# Altium schematic sheet Driver.SchDoc
size A3; SheetNumber: 1; SheetTotal: 1
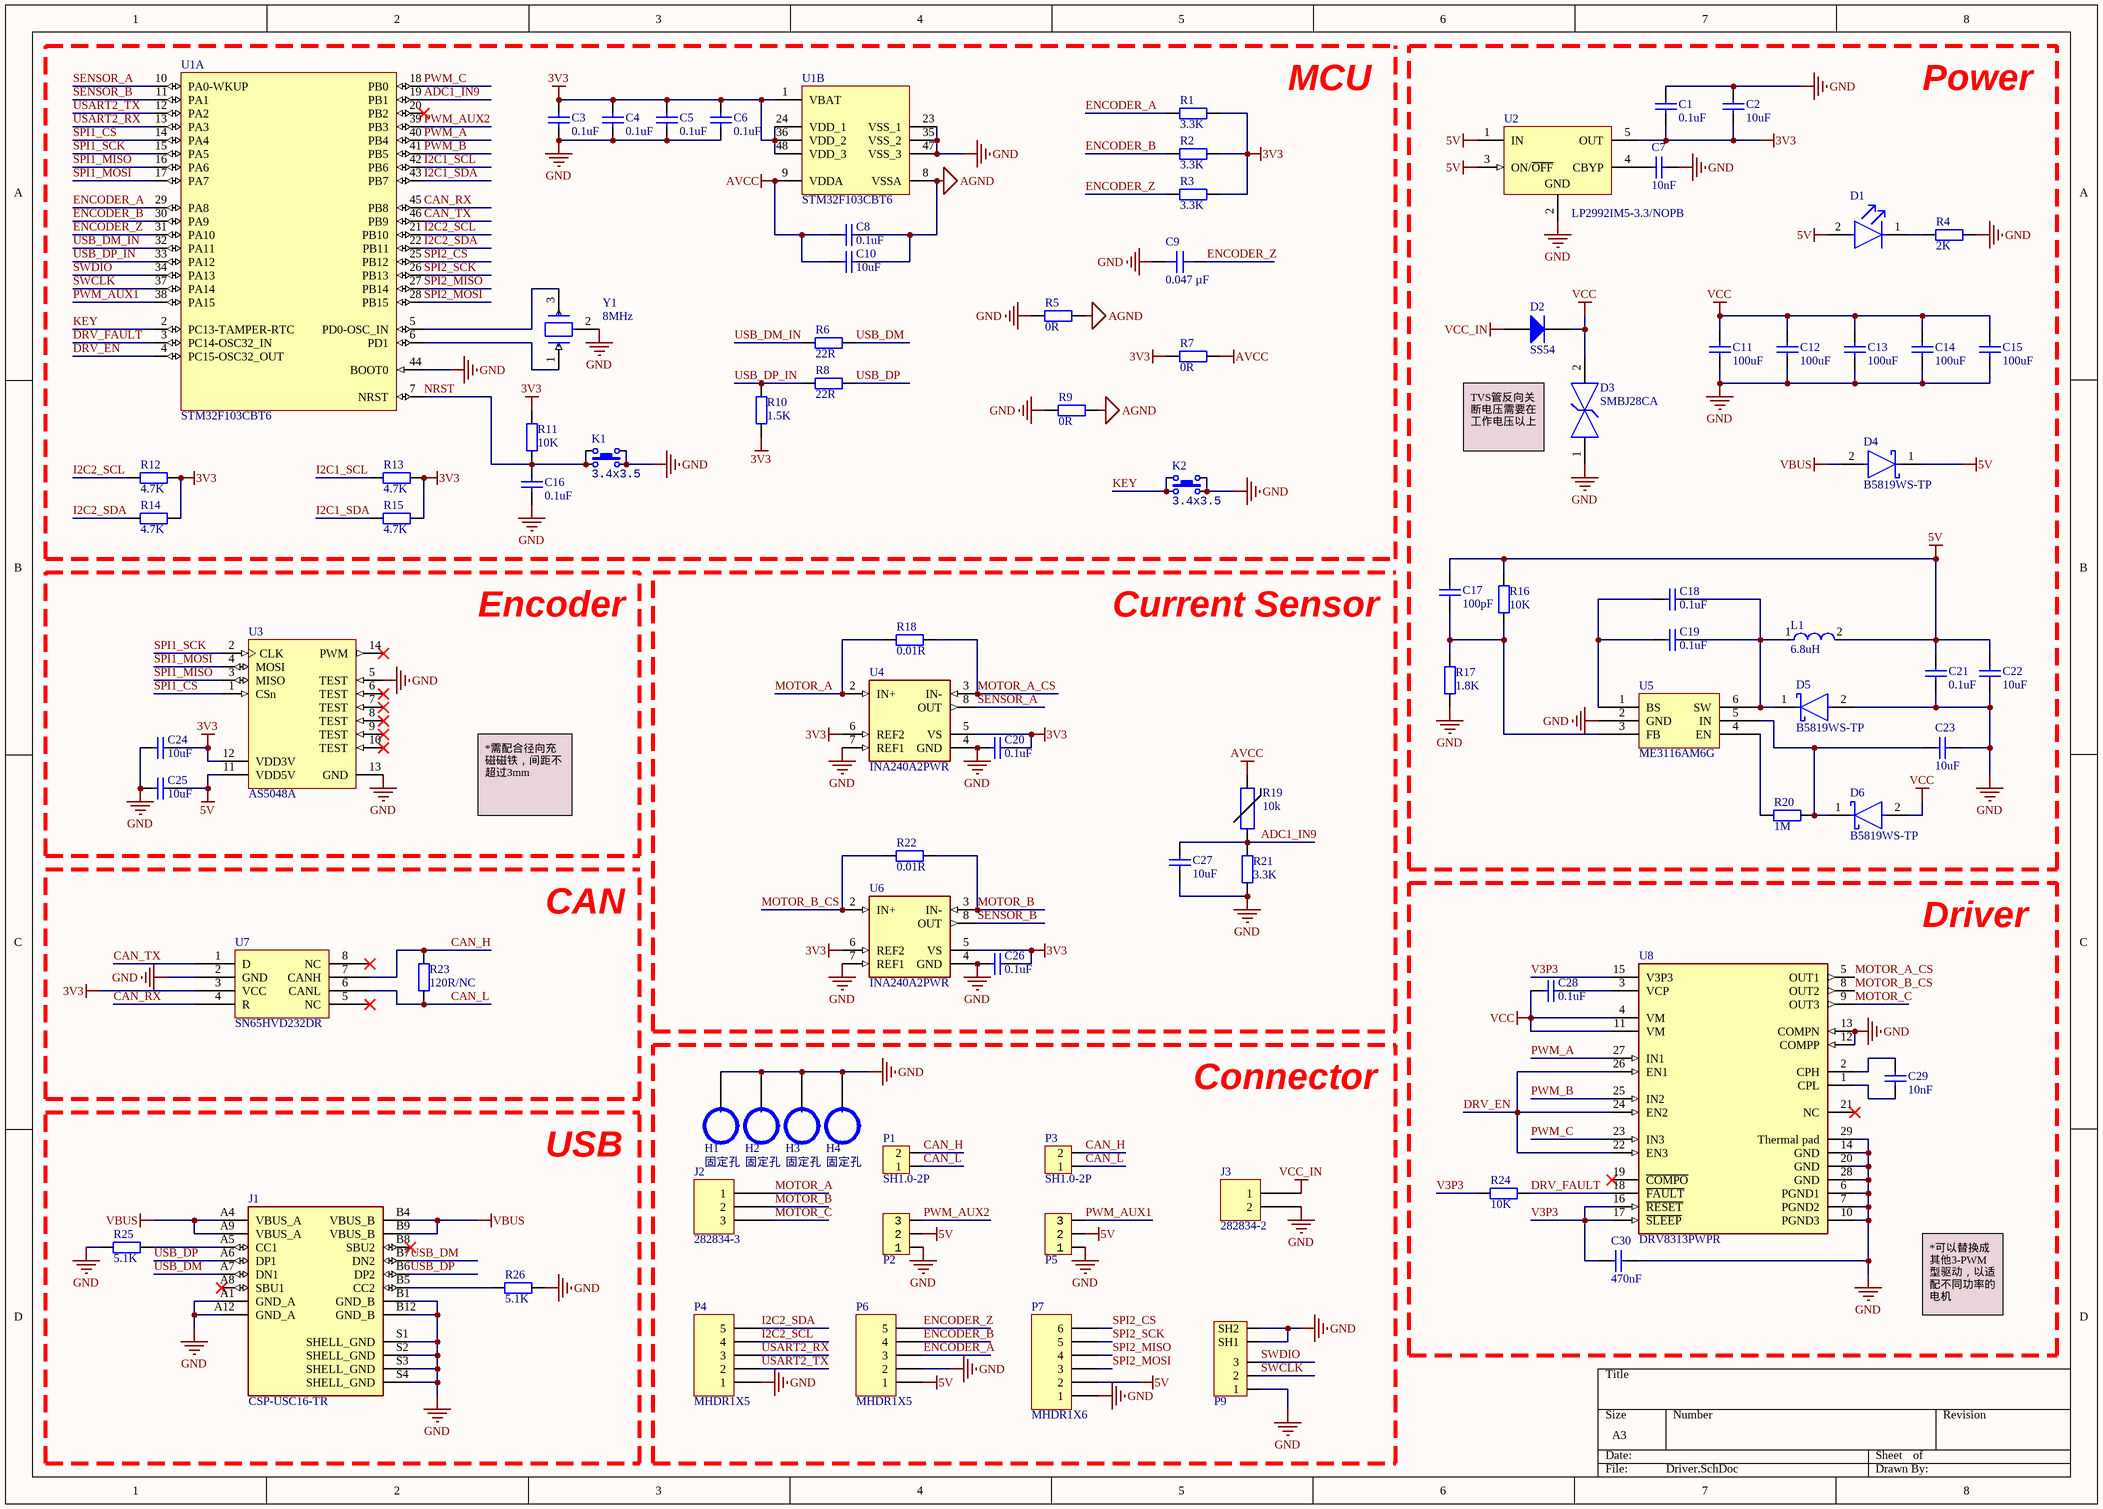
[diagram p0: Driver.SchDoc]

## Parts
C1  0.1uF  [0402_C]
C2  10uF  [0402_C]
C3  0.1uF  [0402_C]
C4  0.1uF  [0402_C]
C5  0.1uF  [0402_C]
C6  0.1uF  [0402_C]
C7  10nF  [0402_C]
C8  0.1uF  [0402_C]
C9  0.047 µF  [CAP 0402_1005]
C10  10uF  [0402_C]
C11  100uF  [CAPC3216X190X55LL30T25]
C12  100uF  [CAPC3216X190X55LL30T25]
C13  100uF  [CAPC3216X190X55LL30T25]
C14  100uF  [CAPC3216X190X55LL30T25]
C15  100uF  [CAPC3216X190X55LL30T25]
C16  0.1uF  [0402_C]
C17  100pF  [0402_C]
C18  0.1uF  [0402_C]
C19  0.1uF  [0402_C]
C20  0.1uF  [0402_C]
C21  0.1uF  [0402_C]
C22  10uF  [0402_C]
C23  10uF  [0402_C]
C24  10uF  [0402_C]
C25  10uF  [0402_C]
C26  0.1uF  [0402_C]
C27  10uF  [0402_C]
C28  0.1uF  [0402_C]
C29  10nF  [0402_C]
C30  470nF  [0402_C]
D1  (no value)  [FP-APHHS1005CGCK-MFG]
D2  SS54  [SMA(DO-214AC)_S1]
D3  SMBJ28CA  [FP-SMBJ-CA-MFG]
D4  B5819WS-TP  [FP-SOD-323-IPC_C]
D5  B5819WS-TP  [FP-SOD-323-IPC_C]
D6  B5819WS-TP  [FP-SOD-323-IPC_C]
H1  固定孔  [铜柱孔3]
H2  固定孔  [铜柱孔3]
H3  固定孔  [铜柱孔3]
H4  固定孔  [铜柱孔3]
J1  CSP-USC16-TR  [VALCON_CSP-USC16-TR]
J2  282834-3  [TE 282834-3]
J3  282834-2  [TE 282834-2]
K1  value 3.4x3.5  [ButtonTACT_3.5*3.55_90]  (hidden comment: TACT 4P)
K2  value 3.4x3.5  [ButtonTACT_3.5*3.55_90]  (hidden comment: TACT 4P)
L1  6.8uH  [FP-LQH2MCN_52-MFG]
P1  SH1.0-2P  [SH1.0-2P]
P2  HDR1x3_2.54  [HDR1X3_2.54_180]  (value not drawn)
P3  SH1.0-2P  [SH1.0-2P]
P4  MHDR1X5  [MHDR1X5]
P5  HDR1x3_2.54  [HDR1X3_2.54_180]  (value not drawn)
P6  MHDR1X5  [MHDR1X5]
P7  MHDR1X6  [MHDR1X6]
P9  SH1.0-3P  [SH1.0-3P]  (value not drawn)
R1  3.3K  [0402_R]
R2  3.3K  [0402_R]
R3  3.3K  [0402_R]
R4  2K  [0402_R]
R5  0R  [0402_R]
R6  22R  [0402_R]
R7  0R  [0402_R]
R8  22R  [0402_R]
R9  0R  [0402_R]
R10  1.5K  [0402_R]
R11  10K  [0402_R]
R12  4.7K  [0402_R]
R13  4.7K  [0402_R]
R14  4.7K  [0402_R]
R15  4.7K  [0402_R]
R16  10K  [0402_R]
R17  1.8K  [0402_R]
R18  0.01R  [0402_R]
R19  value 10k  [RES_0402]  (hidden comment: NCP15XH103F03RC)
R20  1M  [0402_R]
R21  3.3K  [0402_R]
R22  0.01R  [0402_R]
R23  120R/NC  [0402_R]
R24  10K  [0402_R]
R25  5.1K  [0402_R]
R26  5.1K  [0402_R]
U1  STM32F103CBT6  [LQFP-48_7x7x05P]  (parts A,B of 2)
U2  LP2992IM5-3.3/NOPB  [DBV0005A_L]
U3  AS5048A  [TSSOP-14]
U4  INA240A2PWR  [SOP65 P640X120-8N]
U5  ME3116AM6G  [SOT-23-6]
U6  INA240A2PWR  [SOP65 P640X120-8N]
U7  Manufacturer Part Number: SN65HVD232DR  [SO-8]  (hidden comment: SN65HVD232D)
U8  DRV8313PWPR  [FP-PWP0028C-IPC_B]
Y1  8MHz  [FP-CSTNE8M00GH5C000R0-MFG]

## Blocks framed on the sheet
MCU: C3-C6 C8-C10 C16 K1 K2 R1-R3 R5-R15 U1 Y1
Power: C1 C2 C7 C11-C15 C17-C19 C21-C23 D1-D6 L1 R4 R16 R17 R20 U2 U5
Encoder: C24 C25 U3
Current Sensor: C20 C26 C27 R18 R19 R21 R22 U4 U6
CAN: R23 U7
Driver: C28-C30 R24 U8
Connector: H1-H4 J2 J3 P1-P7 P9
USB: J1 R25 R26

## Nets
3V3: C1.1 C2.1 C3.1 C4.1 C5.1 C6.1 C20.1 C24.1 C26.1 R1.2 R2.2 R3.2 R7.1 R10.1 R11.2 R12.2 R13.2 R14.2 R15.2 U1.1(VBAT) U1.24(VDD_1) U1.36(VDD_2) U1.48(VDD_3) U2.5(OUT) U3.12(VDD3V) U4.5(VS) U4.6(REF2) U6.5(VS) U6.6(REF2) U7.3(VCC)
5V: C17.2 C21.1 C22.2 C25.1 D1.2(A) D4.1(C) L1.2 P2.2 P5.2 P6.1 P7.2 R16.2 U2.1(IN) U2.3(ON/~{OFF}) U3.11(VDD5V)
AGND: C8.1 C10.1 R5.2 R9.2 U1.8(VSSA)
AVCC: C8.2 C10.2 R7.2 R19.2 U1.9(VDDA)
GND: C1.2 C2.2 C3.2 C4.2 C5.2 C6.2 C7.1 C9.1 C11.1 C12.1 C13.1 C14.1 C15.1 C16.2 C20.2 C21.2 C22.1 C23.1 C24.2 C25.2 C26.2 C27.2 C30.2 D3.1 D5.2(A) H1.11 H2.11 H3.11 H4.11 J1.A1(GND_A) J1.A12(GND_A) J1.B1(GND_B) J1.B12(GND_B) J1.S1(SHELL_GND) J1.S2(SHELL_GND) J1.S3(SHELL_GND) J1.S4(SHELL_GND) J3.2 K1.2 K1.4 K2.2 K2.4 P2.1 P4.1 P5.1 P6.2 P7.1 P9.1 P9.SH1 P9.SH2 R4.2 R5.1 R9.1 R17.1 R21.1 R25.2 R26.1 U1.23(VSS_1) U1.35(VSS_2) U1.44(BOOT0) U1.47(VSS_3) U2.2(GND) U3.5(TEST) U3.13(GND) U4.4(GND) U4.7(REF1) U5.2(GND) U6.4(GND) U6.7(REF1) U7.2(GND) U8.6(PGND1) U8.7(PGND2) U8.10(PGND3) U8.12(COMPP) U8.13(COMPN) U8.14(GND) U8.20(GND) U8.28(GND) U8.29(Thermal_pad) Y1.2(GND)
VBUS: D4.2(A) J1.A4(VBUS_A) J1.A9(VBUS_A) J1.B4(VBUS_B) J1.B9(VBUS_B)
VCC: C11.2 C12.2 C13.2 C14.2 C15.2 C28.2 D2.2(K) D3.2 D6.2(A) U8.4(VM) U8.11(VM)
VCC_IN: D2.1(A) J3.1
ADC1_IN9: C27.1 R19.1 R21.2 U1.19(PB1)
CAN_H: P1.2 P3.2 R23.2 U7.7(CANH)
CAN_L: P1.1 P3.1 R23.1 U7.6(CANL)
CAN_RX: U1.45(PB8) U7.4(R)
CAN_TX: U1.46(PB9) U7.1(D)
DRV_EN: U1.4(PC15-OSC32_OUT) U8.22(EN3) U8.24(EN2) U8.26(EN1)
DRV_FAULT: R24.1 U1.3(PC14-OSC32_IN) U8.18(~{FAULT})
ENCODER_A: P6.3 R1.1 U1.29(PA8)
ENCODER_B: P6.4 R2.1 U1.30(PA9)
ENCODER_Z: C9.2 P6.5 R3.1 U1.31(PA10)
I2C1_SCL: R13.1 U1.42(PB6)
I2C1_SDA: R15.1 U1.43(PB7)
I2C2_SCL: P4.4 R12.1 U1.21(PB10)
I2C2_SDA: P4.5 R14.1 U1.22(PB11)
KEY: K2.1 K2.3 U1.2(PC13-TAMPER-RTC)
MOTOR_A: J2.1 R18.2 U4.2(IN+)
MOTOR_A_CS: R18.1 U4.3(IN-) U8.5(OUT1)
MOTOR_B: J2.2 R22.1 U6.3(IN-)
MOTOR_B_CS: R22.2 U6.2(IN+) U8.8(OUT2)
MOTOR_C: J2.3 U8.9(OUT3)
NRST: C16.1 K1.1 K1.3 R11.1 U1.7(NRST)
PWM_A: U1.40(PB4) U8.27(IN1)
PWM_AUX1: P5.3 U1.38(PA15)
PWM_AUX2: P2.3 U1.39(PB3)
PWM_B: U1.41(PB5) U8.25(IN2)
PWM_C: U1.18(PB0) U8.23(IN3)
SENSOR_A: U1.10(PA0-WKUP) U4.8(OUT)
SENSOR_B: U1.11(PA1) U6.8(OUT)
SPI1_CS: U1.14(PA4) U3.1(CSn)
SPI1_MISO: U1.16(PA6) U3.3(MISO)
SPI1_MOSI: U1.17(PA7) U3.4(MOSI)
SPI1_SCK: U1.15(PA5) U3.2(CLK)
SPI2_CS: P7.6 U1.25(PB12)
SPI2_MISO: P7.4 U1.27(PB14)
SPI2_MOSI: P7.3 U1.28(PB15)
SPI2_SCK: P7.5 U1.26(PB13)
SWCLK: P9.2 U1.37(PA14)
SWDIO: P9.3 U1.34(PA13)
USART2_RX: P4.3 U1.13(PA3)
USART2_TX: P4.2 U1.12(PA2)
USB_DM: J1.A7(DN1) J1.B7(DN2) R6.2
USB_DM_IN: R6.1 U1.32(PA11)
USB_DP: J1.A6(DP1) J1.B6(DP2) R8.2
USB_DP_IN: R8.1 R10.2 U1.33(PA12)
V3P3: C30.1 R24.2 U8.15(V3P3) U8.16(~{RESET}) U8.17(~{SLEEP})
NetC7_2: C7.2 U2.4(CBYP)
NetC17_1: C17.1 R16.1 R17.2 U5.3(FB)
NetC18_1: C18.1 C19.1 D5.1(C) L1.1 U5.6(SW)
NetC18_2: C18.2 C19.2 U5.1(BS)
NetC23_2: C23.2 D6.1(C) R20.1 U5.5(IN)
NetC28_1: C28.1 U8.3(VCP)
NetC29_1: C29.1 U8.1(CPL)
NetC29_2: C29.2 U8.2(CPH)
NetD1_1: D1.1(C) R4.1
NetJ1_A5: J1.A5(CC1) R25.1
NetJ1_B5: J1.B5(CC2) R26.2
NetR20_2: R20.2 U5.4(EN)
NetU1_5: U1.5(PD0-OSC_IN) Y1.3(Output)
NetU1_6: U1.6(PD1) Y1.1(Input)

Not connected (* = marked no-connect by the designer): J1 A8(SBU1)* B8(SBU2)*; U1 20(PB2)*; U3 6(TEST)* 7(TEST)* 8(TEST)* 9(TEST)* 10(TEST)* 14(PWM)*; U7 5(NC)* 8(NC)*; U8 19(~{COMPO})* 21(NC)*

## Notes on the sheet
- TVS管反向关断电压需要在工作电压以上
- *需配合径向充磁磁铁，间距不超过3mm
- *可以替换成其他3-PWM型驱动，以适配不同功率的电机

## Library data of the parts
C1-C8 C10 C16 C18-C28 = 0402 100nF (104) 10% 16V: 贴片电容; ComponentLink1Description: 供应商链接; ComponentLink1URL: http://www.szlcsc.com/product/details_1877.html; Package: 0402; Supplier: LC; SuppliersPartNumber: C1525
C9 = C0402C473K3REC7867: CAP CER 0402 47NF 25V X7R 10%; manufacturer: KEMET; Part Number: C0402C473K3REC7867; Value: 0.047 µF; Applications: ESD Protection; Capacitance: 0.047 µF; componentlink1description: Datasheet; componentlink1url: https://api.kemet.com/component-edge/download/datasheet/C0402C473K3REC7867.pdf; componentlink2description: DigiKey Link; componentlink2url: https://www.digikey.com/en/products/detail/kemet/C0402C473K3REC7867/8643594; Device Package: 0402 (1005 Metric); lastupdated: 2022/8/26 11:23:32; Lifecycle Status: Active; Minimum Order: 1; Mounting Type: Surface Mount, MLCC; Operating Temperature: -55°C ~ 125°C; Package / Case: 0402 (1005 Metric); packaging: TapeAndReel; partid: 33555; Part Status: Active; price: 0.01; series: ESD SMD Comm X7R; Size / Dimension: 0.039" L x 0.020" W (1.00mm x 0.50mm); Supplier 1: DigiKey; Supplier Part Number 1: 399-C0402C473K3REC7867CT-ND; Temperature Coefficient: X7R; Thickness (Max): 0.022" (0.55mm); Tolerance: ±10%; Voltage - Rated: 25V
C11-C15 = CMP-1662-00011-2: Chip Capacitor, 100 uF, +/- 20%, 6.3 V, -55 to 85 degC, 1206 (3216 Metric), RoHS, Tape and Reel; PartNumber: GRM31CR60J107ME39L; Case\/Package: 1206; Voltage Rating (DC): 6.3 V; Type (Capacitors): X5R; REACH SVHC: No SVHC; Height: 1.6 mm; Tolerance: 20%; Packaging: Tape and Reel; Mount: Surface Mount; PackageDescription: 2-Pin Surface Mount Device, Body 3.2 x 1.6 mm; ComponentLink1URL: http://www.murata.com/; Pins: 2; ComponentLink2Description: Datasheet; PackageReference: 1206; Width: 1.6 mm; Package Quantity: 2000; Capacitance: 100 uF; Min Operating Temperature: -55 degC; Case Code (Imperial): 1206; Max Operating Temperature: 85 degC; DatasheetVersion: 09/2016; Mounting Technology: Surface Mount; Voltage Rating: 6.3 V; ComponentLink1Description: Manufacturer URL; Radiation Hardening: No; Case Code (Metric): 3216; Length: 3.2 mm; ComponentLink2URL: http://psearch.en.murata.com/capacitor/product/GRM31CR60J107ME39%23.pdf; RoHSCompliant: true
C17 = 0402 100pF (101) 5% 50V: 贴片电容; ComponentLink1Description: 供应商链接; ComponentLink1URL: http://www.szlcsc.com/product/details_1898.html; Package: 0402; Supplier: LC; SuppliersPartNumber: C1546
C29 = 0402 10nF (103) 10% 50V: 贴片电容; ComponentLink1Description: 供应商链接; ComponentLink1URL: http://www.szlcsc.com/product/details_15869.html; Package: 0402; Supplier: LC; SuppliersPartNumber: C15195
C30 = 0402 470nF (474) 10% 10V: 贴片电容; ComponentLink1Description: 供应商链接; ComponentLink1URL: http://www.szlcsc.com/product/details_48344.html; Package: 0402; Supplier: LC; SuppliersPartNumber: C47339
D1 = CMP-44529-000044-1: LED GREEN CLEAR CHIP SMD; Viewing Angle: 120°; Dominant Wavelength: 570nm; Test Current: 20mA; Luminous Intensity: 50mcd; Forward Voltage: 2.1V; Number of LEDs: 1; Lens Color: Clear; Packaging: Tape and Reel; Max Operating Temperature: 85°C; Illumination Color: Green; Length: 1mm; Mount: Surface Mount; Lens Style: Clear; Color: Green; Number of Pins: 2; Wavelength: 570nm; Case/Package: 0402; Width: 0.5mm; Package Quantity: 2000; Case Code (Metric): 1005; Height: 0.6mm; Lead Free: Lead Free; Case Code (Imperial): 0402; Forward Current: 20mA; Min Operating Temperature: -40°C
D2 = SMA(DO-214AC) SS54: 二极管; ComponentLink1Description: 供应商链接; ComponentLink1URL: http://www.szlcsc.com/product/details_23178.html; Package: SMA(DO-214AC); Supplier: LC; SuppliersPartNumber: C22452
D3 = CMP-08607-000057-1: TVS DIODE 28V 45.4V DO214AA; Manufacturer: Littelfuse Inc; Direction: Bidirectional; Peak Pulse Power: 600W; Max Junction Temp: +150°C; Peak Pulse Current: 13.3A; Breakdown Voltage: 31.1V; Number Of Channels: 1; Digikey Description: TVS DIODE 28V 45.4V DO214AA; Temperature Range Low: -65°C; Device Class L1: Circuit Protection; Automotive: No; Device Class L3: unset; Octopart: https://octopart.com/smbj28ca-littelfuse-350757; Temperature Range High: +150°C; Reverse Standoff Voltage: 28V; Mouser Description: In a Pack of 10, Littelfuse SMBJ28CA, Bi-Directional TVS Diode, 600W, 2-Pin DO-214AA; Category: Diode; Device Class L2: TVS Diodes; ComponentLink2URL: https://www.littelfuse.com/~/media/electronics/datasheets/tvs_diodes/littelfuse_tvs_diode_smbj_datasheet.pdf.pdf; Clamping Voltage: 45.4V; Manufacturer Part Number: SMBJ28CA; RoHS: TRUE; Height: 2.61mm; Package: SMBJ-CA; ComponentLink2Description: Datasheet; Lead Free: Yes; Temperature: -65°C to +150°C
D4-D6 = CMP-56206-000009-1: DIODE SCHOTTKY 40V 1A SOD323; Max Reverse Leakage Current: 1mA; Peak Non-Repetitive Surge Current: 10A; Forward Voltage: 900mV; Element Configuration: Single; Max Reverse Voltage (DC): 40V; Number of Pins: 2; Max Operating Temperature: 125°C; Package Quantity: 1; Radiation Hardening: No; Average Rectified Current: 1A; Lead Free: Lead Free; Series: -; Mount: Surface Mount; Min Operating Temperature: -65°C; RoHS Compliant: Yes; Packaging: Tape and Reel; Max Surge Current: 10A
J1 = CSP-USC16-TR: CSP-USC16-TR Valcon USB Type C Surface Mount PCB Socket; Package: None; Purchase-URL: https://pricing.snapeda.com/search/part/CSP-USC16-TR/?ref=eda; MP: CSP-USC16-TR; Check_prices: https://www.snapeda.com/parts/CSP-USC16-TR/Valcon/view-part/4783629/?ref=eda; MF: Valcon; Value: *; Availability: No availability data; Price: None; SnapEDA_Link: https://www.snapeda.com/parts/CSP-USC16-TR/Valcon/view-part/4783629/?ref=snap
J2 = 282834-3: TERM BLK 3P SIDE ENT 2.54MM PCB; Manufacturer: TE Connectivity AMP Connectors; Current: 10A; Mating Orientation: Horizontal with Board; Number of Levels: 1; Pitch: 0.100" (2.54mm); Positions Per Level: 3; Voltage: 150V; Wire Gauge: 16-30 AWG; Wire Termination: Screw - Rising Cage Clamp; Part Number: 282834-3; Color: Green; ComponentLink1Description: Datasheet; ComponentLink1URL: https://www.te.com/commerce/DocumentDelivery/DDEController?Action=srchrtrv&DocNm=282834&DocType=Customer+Drawing&DocLang=English; ComponentLink2Description: DigiKey Link; ComponentLink2URL: http://digikey.com/product-detail/en/te-connectivity-amp-connectors/282834-3/A98334-ND/1153264; LastUpdated: 2020/1/15 4:15:50; Lifecycle Status: Active; Minimum Order: 1; Mounting Type: Through Hole; Packaging: Bulk; Part Status: Active; Price: 2.01; Series: Buchanan; Supplier 1: DigiKey; Supplier Part Number 1: A98334-ND
J3 = 282834-2: TERM BLK 2P SIDE ENT 2.54MM PCB; Manufacturer: TE Connectivity AMP Connectors; Current: 10A; Mating Orientation: Horizontal with Board; Number of Levels: 1; Pitch: 0.100" (2.54mm); Positions Per Level: 2; Voltage: 150V; Wire Gauge: 16-30 AWG; Wire Termination: Screw - Rising Cage Clamp; Part Number: 282834-2; Color: Green; ComponentLink1Description: Datasheet; ComponentLink1URL: https://www.te.com/commerce/DocumentDelivery/DDEController?Action=srchrtrv&DocNm=282834&DocType=Customer+Drawing&DocLang=English; ComponentLink2Description: DigiKey Link; ComponentLink2URL: http://digikey.com/product-detail/en/te-connectivity-amp-connectors/282834-2/A98333-ND/1150135; LastUpdated: 2020/1/15 4:15:38; Lifecycle Status: Active; Minimum Order: 1; Mounting Type: Through Hole; Packaging: Bulk; Part Status: Active; Price: 0.88; Series: Buchanan; Supplier 1: DigiKey; Supplier Part Number 1: A98333-ND
K1 K2 = ButtonTACT: Button; type: TACT 4P
L1 = CMP-06042-015166-1: Wire Wound Ferrite Inductor for Power Lines 6.8μH ±20% 1.6Ω 285mA 0806; Shielding: Unshielded; Test Frequency: 1MHz; Self Resonant Frequency: 65MHz; DC Resistance (DCR): 1.6R; Military Standard: Not; Length: 2mm; Case Code (Metric): 2016; Current Rating: 285mA; Package Quantity: 3000; Weight: 0.000317oz; Case Code (Imperial): 0806; Max Operating Temperature: 85°C; Width: 0.063inch; DC Current: 285mA; Core Material: Ferrite; Resistor Type: Wirewound; Inductance: 6.8uH; Height - Seated (Max): 0.037inch; Max DC Current: 285mA; Depth: 1.8mm; Termination: SMD/SMT; Min Operating Temperature: -40°C; Case/Package: 0806; Mount: Surface Mount; Tolerance: 20%; Packaging: Tape and Reel; Height: 0.9mm; Radiation Hardening: No
P2 P5 = HDR1x3_2.54: Header
P4 P6 = MHDR1X5: Header, 5-Pin; LatestRevisionDate: 17-Jul-2002; LatestRevisionNote: Re-released for DXP Platform.; Publisher: Altium Limited
P7 = MHDR1X6: Header, 6-Pin; LatestRevisionDate: 17-Jul-2002; LatestRevisionNote: Re-released for DXP Platform.; Publisher: Altium Limited
P9 = SH1.0-3P: Header
R1-R3 R21 = 0402 3.3KΩ (3301) 1%: 贴片电阻; ComponentLink1Description: 供应商链接; ComponentLink1URL: http://www.szlcsc.com/product/details_26633.html; Package: 0402; Supplier: LC; SuppliersPartNumber: C25890
R4 R20 = 0402 2KΩ (2001) 1%: 贴片电阻; ComponentLink1Description: 供应商链接; ComponentLink1URL: http://www.szlcsc.com/product/details_4516.html; Package: 0402; Supplier: LC; SuppliersPartNumber: C4109
R5 R7 R9 = 0402 0Ω (0R0) 1%: 贴片电阻; ComponentLink1Description: 供应商链接; ComponentLink1URL: http://www.szlcsc.com/product/details_17853.html; Package: 0402; Supplier: LC; SuppliersPartNumber: C17168
R6 R8 R18 R22 = 0402 22Ω (22R0) 1%: 贴片电阻; ComponentLink1Description: 供应商链接; ComponentLink1URL: http://www.szlcsc.com/product/details_25835.html; Package: 0402; Supplier: LC; SuppliersPartNumber: C25092
R10 = 0402 1.5KΩ (1501) 1%: 贴片电阻; ComponentLink1Description: 供应商链接; ComponentLink1URL: http://www.szlcsc.com/product/details_26610.html; Package: 0402; Supplier: LC; SuppliersPartNumber: C25867
R11 = 0402 10KΩ (1002) 1%: 贴片电阻; ComponentLink1Description: 供应商链接; ComponentLink1URL: http://www.szlcsc.com/product/details_26487.html; Package: 0402; Supplier: LC; SuppliersPartNumber: C25744
R12-R15 = 0402 4.7KΩ (4701) 1%: 贴片电阻; ComponentLink1Description: 供应商链接; ComponentLink1URL: http://www.szlcsc.com/product/details_26643.html; Package: 0402; Supplier: LC; SuppliersPartNumber: C25900
R16 R17 R24-R26 = 0402 1.2KΩ (1201) 1%: 贴片电阻; ComponentLink1Description: 供应商链接; ComponentLink1URL: http://www.szlcsc.com/product/details_26605.html; Package: 0402; Supplier: LC; SuppliersPartNumber: C25862
R19 = NCP15XH103F03RC: THERMISTOR 10K OHM NTC 0402 SMD
R23 = 0402 120Ω (1200) 1%: 贴片电阻; ComponentLink1Description: 供应商链接; ComponentLink1URL: http://www.szlcsc.com/product/details_25822.html; Package: 0402; Supplier: LC; SuppliersPartNumber: C25079
U1 = STM32F103CBT6: ARM; ComponentLink1Description: 供应商链接; ComponentLink1URL: http://www.szlcsc.com/product/details_8796.html; Package: LQFP-48_7x7x05P; Supplier: LC; SuppliersPartNumber: C8304
U2 = CMP-0062-02175-3: Micropower 250 mA Low-Noise Ultra Low-Dropout Regulator, 5-pin SOT-23, Pb-Free; Manufacturer: Texas Instruments; CompType: LDO IC; PackageTopMarking: LFEB*XTT; PowerWise: N; PackageReference: DBV0005A; ComponentLink1Description: Datasheet URL; RoHS: Y; PackageDescription: Molded SOT-23, .115 x .063 x .040 in Body, 5 Lead, .0375 in Pitch; ComponentLink1URL: http://www.ti.com/general/docs/lit/getliterature.tsp?genericPartNumber=LP2992&fileType=pdf; PinCount: 5
U3 = AS5048A: 14 位旋转式位置传感器
U4 U6 = INA240A2PWR: -4 to 80V, bidirectional, ultra-precise current sense amplifier with enhanced PWM rejection 8-TSSOP -40 to 125; MF: Texas Instruments; MP: INA240A2PWR; Value: *; Package: TSSOP-8 Texas Instruments; Price: None; Availability: Good; Purchase-URL: https://pricing.snapeda.com/search/part/INA240A2PWR/?ref=eda; SnapEDA_Link: https://www.snapeda.com/parts/INA240A2PWR/Texas%20Instruments/view-part/588604/?ref=snap
U5 = ME3116AM6G: DC/DC降压型稳压器
U7 = SN65HVD232D: Manufacturer: Texas Instruments; Protocol: CAN; Number of Drivers/Receivers: 1/1; Duplex: Half; Data Rate: 1Mbps; Voltage - Supply: 3 V ~ 3.6 V; Supplier 1: Digi-Key; Supplier Part Number 1: 296-26344-2-ND; RoHS: RoHS Compliant; Category: Integrated Circuits (ICs); Stock: 5000; Pricing 1: 2500=0.84375 (USD); Packaging: Tape & Reel (TR); Part Status: Active; Type: Transceiver; Operating Temperature: -40°C ~ 85°C; Mounting Type: Surface Mount; Package / Case: 8-SOIC (0.154", 3.90mm Width); Supplier Device Package: 8-SOIC; ComponentLink1URL: http://www.ti.com/lit/ds/symlink/sn65hvd230.pdf; ComponentLink1Description: http://www.ti.com/lit/ds/symlink/sn65hvd230.pdf; Supplier 2: Digi-Key; Supplier Part Number 2: 296-26344-1-ND; Pricing 2: 1=2.05, 10=1.842, 100=1.4809, 500=1.21668, 1000=1.00811 (USD)
U8 = CMP-04915-000025-1: IC MOTOR DRIVER 8V-60V 28HTSSOP; Min Supply Voltage: 8V; Max Supply Voltage: 60V; Interface: Parallel; Output Current: 1.75A; Number of Outputs: 1; Logic Function: AND GATE; Package Quantity: 2000; Number of Pins: 28; Case/Package: HTSSOP; Min Operating Temperature: -40°C; Mount: Surface Mount; Series: -; Packaging: Tape and Reel; Max Operating Temperature: 125°C; Lead Free: Lead Free
Y1 = CMP-06057-000001-1: CERAMIC RES 8.0000MHZ 33PF SMD; Frequency Stability: 0.13%; Frequency Tolerance: 0.07%; Impedance: 40R; Mount: Surface Mount; Min Operating Temperature: -40°C; Max Operating Temperature: 125°C; Resistor Type: Ceramic; Capacitance: 33pF; Packaging: Tape and Reel; Frequency: 8MHz; Case/Package: SMD/SMT